# Altium project zhangting v0.0.PrjPCB
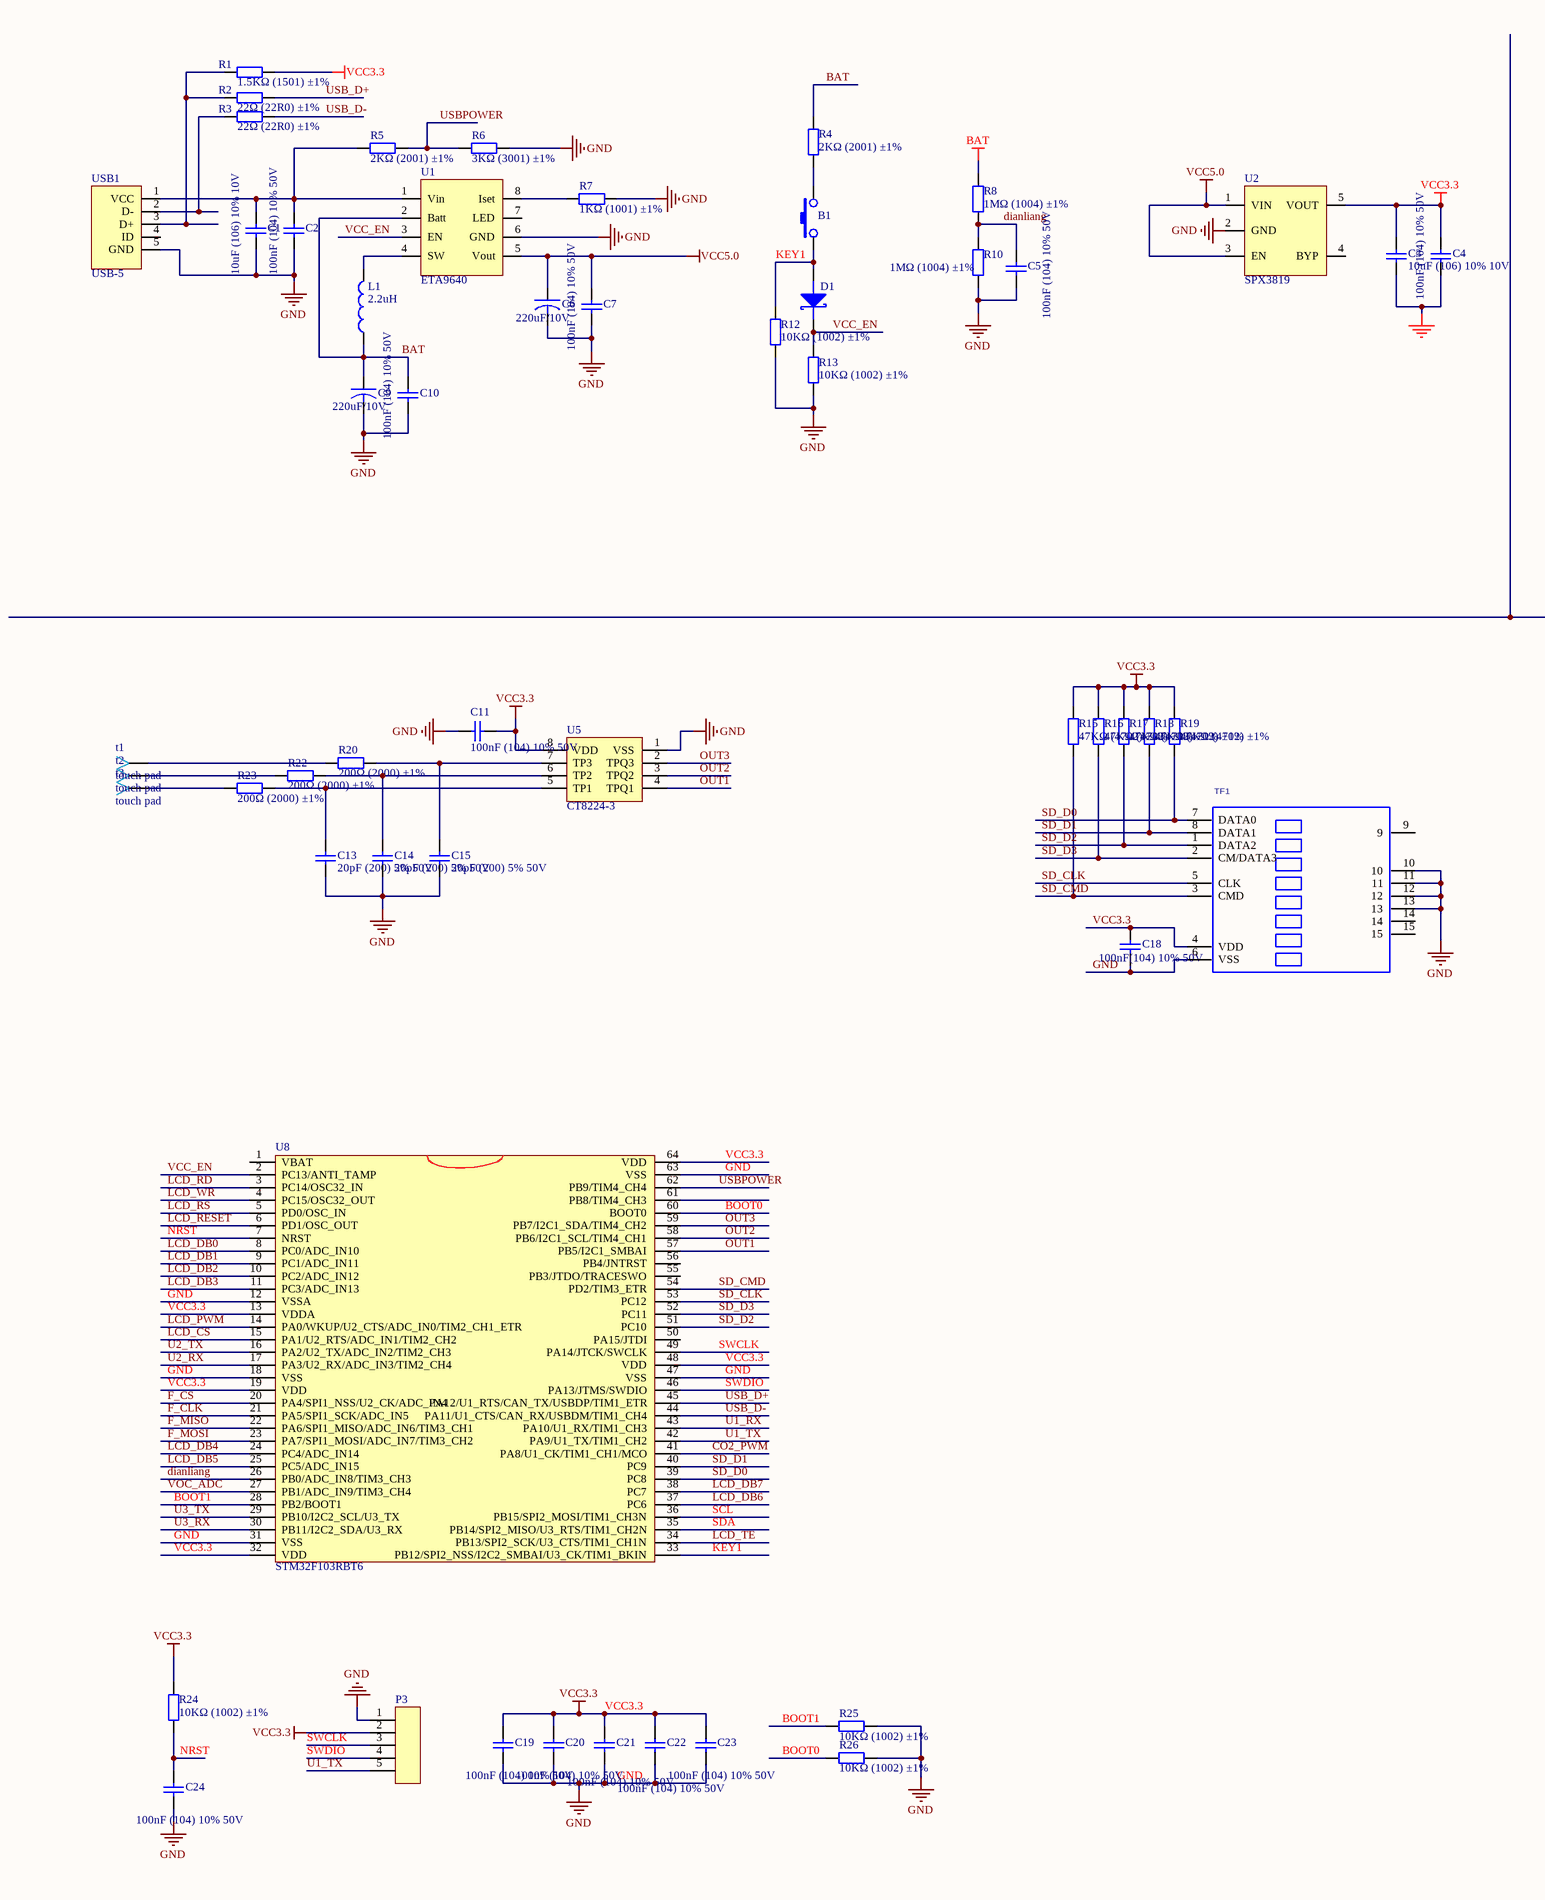
[diagram p0: zhangting v0.0.SchDoc, left]
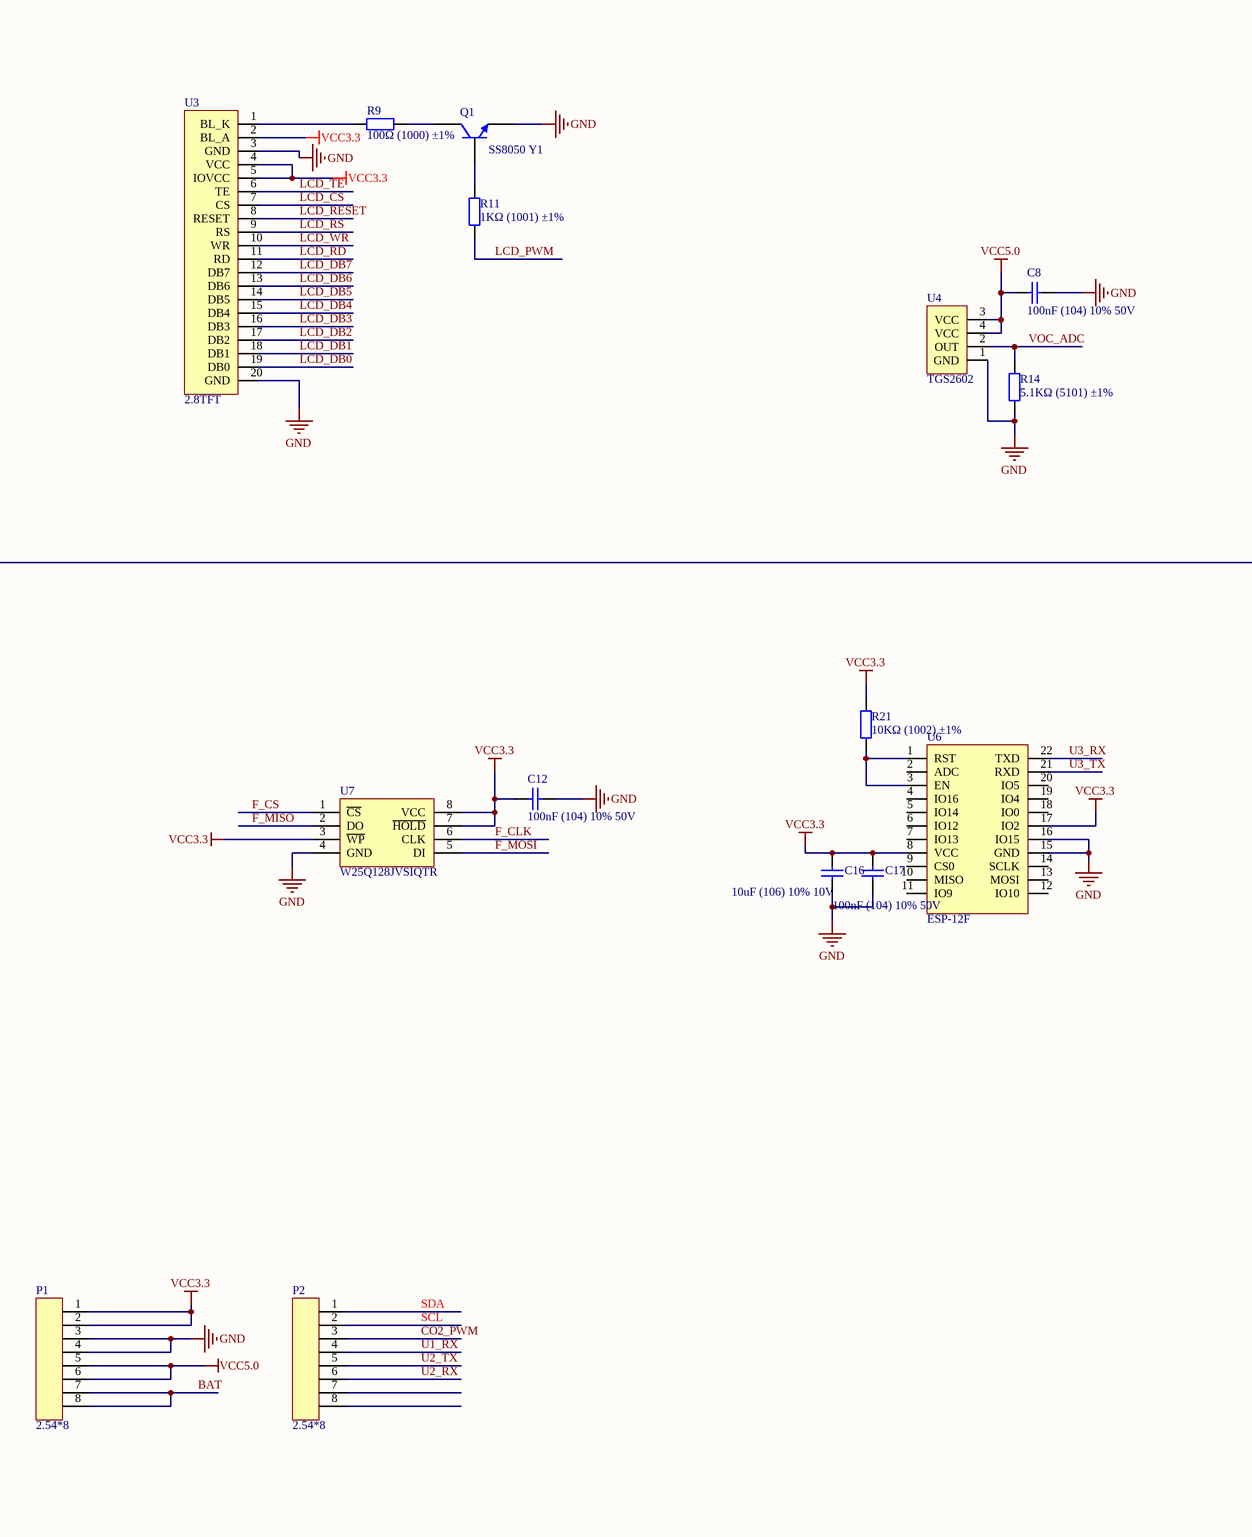
[diagram p1: zhangting v0.0.SchDoc, right]
1 sheet, 70 parts. Net scope: global (net labels, ports and power ports of the same name join across sheets).
Board file: zhangting v0.0.PcbDoc

## Sheet zhangting v0.0.SchDoc
size A2

### Parts
B1  BUTTON侧贴  [BUTTON侧贴]  (value not drawn)
C1  10uF (106) 10% 10V  [0603_C]
C2  100nF (104) 10% 50V  [0603_C]
C3  10uF (106) 10% 10V  [0603_C]
C4  100nF (104) 10% 50V  [0603_C]
C5  100nF (104) 10% 50V  [0603_C]
C6  220uF/10V  [SMD-6.5mm]
C7  100nF (104) 10% 50V  [0603_C]
C8  100nF (104) 10% 50V  [0603_C]
C9  220uF/10V  [SMD-6.5mm]
C10  100nF (104) 10% 50V  [0603_C]
C11  100nF (104) 10% 50V  [0603_C]
C12  100nF (104) 10% 50V  [0603_C]
C13  20pF (200) 5% 50V  [0603_C]
C14  20pF (200) 5% 50V  [0603_C]
C15  20pF (200) 5% 50V  [0603_C]
C16  10uF (106) 10% 10V  [0603_C]
C17  100nF (104) 10% 50V  [0603_C]
C18  100nF(104) 10% 50V  [0805_C]
C19  100nF (104) 10% 50V  [0603_C]
C20  100nF (104) 10% 50V  [0603_C]
C21  100nF (104) 10% 50V  [0603_C]
C22  100nF (104) 10% 50V  [0603_C]
C23  100nF (104) 10% 50V  [0603_C]
C24  100nF (104) 10% 50V  [0603_C]
D1  IN4148  [DIODE(SMA)]  (value not drawn)
L1  2.2uH  [L(CD74)]
P1  2.54*8  [2.54*8]
P2  2.54*8  [2.54*8]
P3  2.54*5  [2.54*5]  (value not drawn)
Q1  SS8050 Y1  [SOT-23(SOT-23-3)]
R1  1.5KΩ (1501) ±1%  [0603_R]
R2  22Ω (22R0) ±1%  [0603_R]
R3  22Ω (22R0) ±1%  [0603_R]
R4  2KΩ (2001) ±1%  [0603_R]
R5  2KΩ (2001) ±1%  [0603_R]
R6  3KΩ (3001) ±1%  [0603_R]
R7  1KΩ (1001) ±1%  [0603_R]
R8  1MΩ (1004) ±1%  [0603_R]
R9  100Ω (1000) ±1%  [0603_R]
R10  1MΩ (1004) ±1%  [0603_R]
R11  1KΩ (1001) ±1%  [0603_R]
R12  10KΩ (1002) ±1%  [0603_R]
R13  10KΩ (1002) ±1%  [0603_R]
R14  5.1KΩ (5101) ±1%  [0603_R]
R15  47KΩ (4702) ±1%  [0603_R]
R16  47KΩ (4702) ±1%  [0603_R]
R17  47KΩ (4702) ±1%  [0603_R]
R18  47KΩ (4702) ±1%  [0603_R]
R19  47KΩ (4702) ±1%  [0603_R]
R20  200Ω (2000) ±1%  [0603_R]
R21  10KΩ (1002) ±1%  [0603_R]
R22  200Ω (2000) ±1%  [0603_R]
R23  200Ω (2000) ±1%  [0603_R]
R24  10KΩ (1002) ±1%  [0603_R]
R25  10KΩ (1002) ±1%  [0603_R]
R26  10KΩ (1002) ±1%  [0603_R]
t1  touch pad  [touch pad]
t2  touch pad  [touch pad]
t3  touch pad  [touch pad]
TF1  TF_CARD  [TF_CARD]  (value not drawn)
U1  ETA9640  [SOP-8]
U2  SPX3819  [SOT23-5]
U3  2.8TFT  [2.8TFT]
U4  TGS2602  [TGS2602]
U5  CT8224-3  [SOP-8]
U6  ESP-12F  [ESP-12F]
U7  W25Q128JVSIQTR  [SOIC-8_208mil]
U8  STM32F103RBT6  [LQFP64]
USB1  USB-5  [USB-5]

### Nets
BAT: C9.1 C10.2 L1.1 P1.7 P1.8 R4.2 R8.2 U1.2(Batt)
GND: C1.1 C2.1 C3.1 C4.1 C5.1 C6.2 C7.1 C8.1 C9.2 C10.1 C11.2 C12.1 C13.1 C14.1 C15.1 C16.1 C17.1 C18.1 C19.1 C20.1 C21.1 C22.1 C23.1 C24.1 P1.3 P1.4 P3.1 Q1.2(E) R6.2 R7.2 R10.1 R12.1 R13.1 R14.1 R25.1 R26.1 TF1.6(VSS) TF1.10 TF1.11 TF1.12 TF1.13 U1.6(GND) U2.2(GND) U3.3(GND) U3.20(GND) U4.1(GND) U5.1(VSS) U6.15(GND) U6.16(IO15) U7.4(GND) U8.12(VSSA) U8.18(VSS) U8.31(VSS) U8.47(VSS) U8.63(VSS) USB1.5(GND)
VCC3.3: C3.2 C4.2 C11.1 C12.2 C16.2 C17.2 C18.2 C19.2 C20.2 C21.2 C22.2 C23.2 P1.1 P1.2 P3.2 R1.2 R15.2 R16.2 R17.2 R18.2 R19.2 R21.2 R24.2 TF1.4(VDD) U2.5(VOUT) U3.2(BL_A) U3.4(VCC) U3.5(IOVCC) U5.8(VDD) U6.8(VCC) U6.17(IO2) U7.3(~{WP}) U7.7(~{HOLD}) U7.8(VCC) U8.13(VDDA) U8.19(VDD) U8.32(VDD) U8.48(VDD) U8.64(VDD)
VCC5.0: C6.1 C7.2 C8.2 P1.5 P1.6 U1.5(Vout) U2.1(VIN) U2.3(EN) U4.3(VCC) U4.4(VCC)
BOOT0: R26.2 U8.60(BOOT0)
BOOT1: R25.2 U8.28(PB2/BOOT1)
CO2_PWM: P2.3 U8.41(PA8/U1_CK/TIM1_CH1/MCO)
dianliang: C5.2 R8.1 R10.2 U8.26(PB0/ADC_IN8/TIM3_CH3)
F_CLK: U7.6(CLK) U8.21(PA5/SPI1_SCK/ADC_IN5)
F_CS: U7.1(~{CS}) U8.20(PA4/SPI1_NSS/U2_CK/ADC_IN4)
F_MISO: U7.2(DO) U8.22(PA6/SPI1_MISO/ADC_IN6/TIM3_CH1)
F_MOSI: U7.5(DI) U8.23(PA7/SPI1_MOSI/ADC_IN7/TIM3_CH2)
KEY1: B1.1 D1.1(A) R12.2 U8.33(PB12/SPI2_NSS/I2C2_SMBAI/U3_CK/TIM1_BKIN)
LCD_CS: U3.7(CS) U8.15(PA1/U2_RTS/ADC_IN1/TIM2_CH2)
LCD_DB0: U3.19(DB0) U8.8(PC0/ADC_IN10)
LCD_DB1: U3.18(DB1) U8.9(PC1/ADC_IN11)
LCD_DB2: U3.17(DB2) U8.10(PC2/ADC_IN12)
LCD_DB3: U3.16(DB3) U8.11(PC3/ADC_IN13)
LCD_DB4: U3.15(DB4) U8.24(PC4/ADC_IN14)
LCD_DB5: U3.14(DB5) U8.25(PC5/ADC_IN15)
LCD_DB6: U3.13(DB6) U8.37(PC6)
LCD_DB7: U3.12(DB7) U8.38(PC7)
LCD_PWM: R11.1 U8.14(PA0/WKUP/U2_CTS/ADC_IN0/TIM2_CH1_ETR)
LCD_RD: U3.11(RD) U8.3(PC14/OSC32_IN)
LCD_RESET: U3.8(RESET) U8.6(PD1/OSC_OUT)
LCD_RS: U3.9(RS) U8.5(PD0/OSC_IN)
LCD_TE: U3.6(TE) U8.34(PB13/SPI2_SCK/U3_CTS/TIM1_CH1N)
LCD_WR: U3.10(WR) U8.4(PC15/OSC32_OUT)
NRST: C24.2 R24.1 U8.7(NRST)
OUT1: U5.4(TPQ1) U8.57(PB5/I2C1_SMBAI)
OUT2: U5.3(TPQ2) U8.58(PB6/I2C1_SCL/TIM4_CH1)
OUT3: U5.2(TPQ3) U8.59(PB7/I2C1_SDA/TIM4_CH2)
SCL: P2.2 U8.36(PB15/SPI2_MOSI/TIM1_CH3N)
SD_CLK: TF1.5(CLK) U8.53(PC12)
SD_CMD: R15.1 TF1.3(CMD) U8.54(PD2/TIM3_ETR)
SD_D0: R19.1 TF1.7(DATA0) U8.39(PC8)
SD_D1: R18.1 TF1.8(DATA1) U8.40(PC9)
SD_D2: R17.1 TF1.1(DATA2) U8.51(PC10)
SD_D3: R16.1 TF1.2(CM/DATA3) U8.52(PC11)
SDA: P2.1 U8.35(PB14/SPI2_MISO/U3_RTS/TIM1_CH2N)
SWCLK: P3.3 U8.49(PA14/JTCK/SWCLK)
SWDIO: P3.4 U8.46(PA13/JTMS/SWDIO)
U1_RX: P2.4 U8.43(PA10/U1_RX/TIM1_CH3)
U1_TX: P3.5 U8.42(PA9/U1_TX/TIM1_CH2)
U2_RX: P2.6 U8.17(PA3/U2_RX/ADC_IN3/TIM2_CH4)
U2_TX: P2.5 U8.16(PA2/U2_TX/ADC_IN2/TIM2_CH3)
U3_RX: U6.22(TXD) U8.30(PB11/I2C2_SDA/U3_RX)
U3_TX: U6.21(RXD) U8.29(PB10/I2C2_SCL/U3_TX)
USB_D+: R2.2 U8.45(PA12/U1_RTS/CAN_TX/USBDP/TIM1_ETR)
USB_D-: R3.2 U8.44(PA11/U1_CTS/CAN_RX/USBDM/TIM1_CH4)
USBPOWER: R5.1 R6.1 U8.62(PB9/TIM4_CH4)
VCC_EN: D1.2(K) R13.2 U1.3(EN) U8.2(PC13/ANTI_TAMP)
VOC_ADC: R14.2 U4.2(OUT) U8.27(PB1/ADC_IN9/TIM3_CH4)
NetB1_2: B1.2 R4.1
NetC1_2: C1.2 C2.2 R5.2 U1.1(Vin) USB1.1(VCC)
NetC13_2: C13.2 R23.2 U5.5(TP1)
NetC14_2: C14.2 R22.2 U5.6(TP2)
NetC15_2: C15.2 R20.2 U5.7(TP3)
NetL1_2: L1.2 U1.4(SW)
NetQ1_1: Q1.1(B) R11.2
NetQ1_3: Q1.3(C) R9.2
NetR1_1: R1.1 R2.1 USB1.3(D+)
NetR3_1: R3.1 USB1.2(D-)
NetR7_1: R7.1 U1.8(Iset)
NetR9_1: R9.1 U3.1(BL_K)
NetR20_1: R20.1 t1.1
NetR21_1: R21.1 U6.1(RST) U6.3(EN)
NetR22_1: R22.1 t2.1
NetR23_1: R23.1 t3.1

Not connected (* = marked no-connect by the designer): P2 7 8; TF1 9 14 15; U1 7(LED); U2 4(BYP); U6 2(ADC) 4(IO16) 5(IO14) 6(IO12) 7(IO13) 9(CS0) 10(MISO) 11(IO9) 12(IO10) 13(MOSI) 14(SCLK) 18(IO0) 19(IO4) 20(IO5); U8 1(VBAT) 50(PA15/JTDI) 55(PB3/JTDO/TRACESWO) 56(PB4/JNTRST) 61(PB8/TIM4_CH3); USB1 4(ID)

### Library data of the parts
C1 C3 C16 = 0603 10uF (106) 10% 10V: 贴片电容; ComponentLink1Description: 供应商链接; ComponentLink1URL: http://www.szlcsc.com/product/details_20411.html; Package: 0603; Supplier: LC; SuppliersPartNumber: C19702
C2 C4 C5 C7 C8 C10-C12 C17 C19-C24 = 0603 100nF (104) 10% 50V: 贴片电容; ComponentLink1Description: 供应商链接; ComponentLink1URL: http://www.szlcsc.com/product/details_15331.html; Package: 0603; Supplier: LC; SuppliersPartNumber: C14663
C6 C9 = SMD-CAP
C13-C15 = 0603 20pF (200) 5% 50V: 贴片电容; ComponentLink1Description: 供应商链接; ComponentLink1URL: http://www.szlcsc.com/product/details_2000.html; Package: 0603; Supplier: LC; SuppliersPartNumber: C1648
C18 = 0805 100nF(104) 10% 50V: 贴片电容; ComponentLink1Description: 供应商链接; ComponentLink1URL: http://www.szlcsc.com/product/details_50686.html; Package: 0805; Supplier: LC; SuppliersPartNumber: C49678
D1 = 肖特基二极管
L1 = L(CD74)
Q1 = SOT-23 SS8050 Y1: 三极管; ComponentLink1Description: 供应商链接; ComponentLink1URL: http://www.szlcsc.com/product/details_2507.html; Package: SOT-23; Supplier: LC; SuppliersPartNumber: C2150
R1 = 0603 1.5KΩ (1501) 1%: 贴片电阻; ComponentLink1Description: 供应商链接; ComponentLink1URL: http://www.szlcsc.com/product/details_23570.html; Package: 0603; Supplier: LC; SuppliersPartNumber: C22843
R2 R3 = 0603 22Ω (22R0) 1%: 贴片电阻; ComponentLink1Description: 供应商链接; ComponentLink1URL: http://www.szlcsc.com/product/details_24078.html; Package: 0603; Supplier: LC; SuppliersPartNumber: C23345
R4 R5 = 0603 2KΩ (2001) 1%: 贴片电阻; ComponentLink1Description: 供应商链接; ComponentLink1URL: http://www.szlcsc.com/product/details_23702.html; Package: 0603; Supplier: LC; SuppliersPartNumber: C22975
R6 = 0603 3KΩ (3001) 1%: 贴片电阻; ComponentLink1Description: 供应商链接; ComponentLink1URL: http://www.szlcsc.com/product/details_4618.html; Package: 0603; Supplier: LC; SuppliersPartNumber: C4211
R7 R11 = 0603 1KΩ (1001) 1%: 贴片电阻; ComponentLink1Description: 供应商链接; ComponentLink1URL: http://www.szlcsc.com/product/details_21904.html; Package: 0603; Supplier: LC; SuppliersPartNumber: C21190
R8 R10 = 0603 1MΩ (1004) 1%: 贴片电阻; ComponentLink1Description: 供应商链接; ComponentLink1URL: http://www.szlcsc.com/product/details_23662.html; Package: 0603; Supplier: LC; SuppliersPartNumber: C22935
R9 = 0603 100Ω (1000) 1%: 贴片电阻; ComponentLink1Description: 供应商链接; ComponentLink1URL: http://www.szlcsc.com/product/details_23502.html; Package: 0603; Supplier: LC; SuppliersPartNumber: C22775
R12 R13 R21 R24-R26 = 0603 10KΩ (1002) 1%: 贴片电阻; ComponentLink1Description: 供应商链接; ComponentLink1URL: http://www.szlcsc.com/product/details_26547.html; Package: 0603; Supplier: LC; SuppliersPartNumber: C25804
R14 = 0603 5.1KΩ (5101) 1%: 贴片电阻; ComponentLink1Description: 供应商链接; ComponentLink1URL: http://www.szlcsc.com/product/details_23913.html; Package: 0603; Supplier: LC; SuppliersPartNumber: C23186
R15-R19 = 0603 47KΩ (4702) 1%: 贴片电阻; ComponentLink1Description: 供应商链接; ComponentLink1URL: http://www.szlcsc.com/product/details_26562.html; Package: 0603; Supplier: LC; SuppliersPartNumber: C25819
R20 R22 R23 = 0603 200Ω (2000) 1%: 贴片电阻; ComponentLink1Description: 供应商链接; ComponentLink1URL: http://www.szlcsc.com/product/details_8708.html; Package: 0603; Supplier: LC; SuppliersPartNumber: C8218
U7 = W25Q128JVSIQTR_[C97521]: Flash ROM; ComponentLink1Description: 供应商链接; ComponentLink1URL: https://item.szlcsc.com/98729.html; Package: SOIC-8; Supplier: LC; SuppliersPartNumber: C97521
TF1 = TF_CARD: PCB DECAL: TF_CARD